# Altium project Carrier_Board_V2.PrjPcb (part 1 of 2)
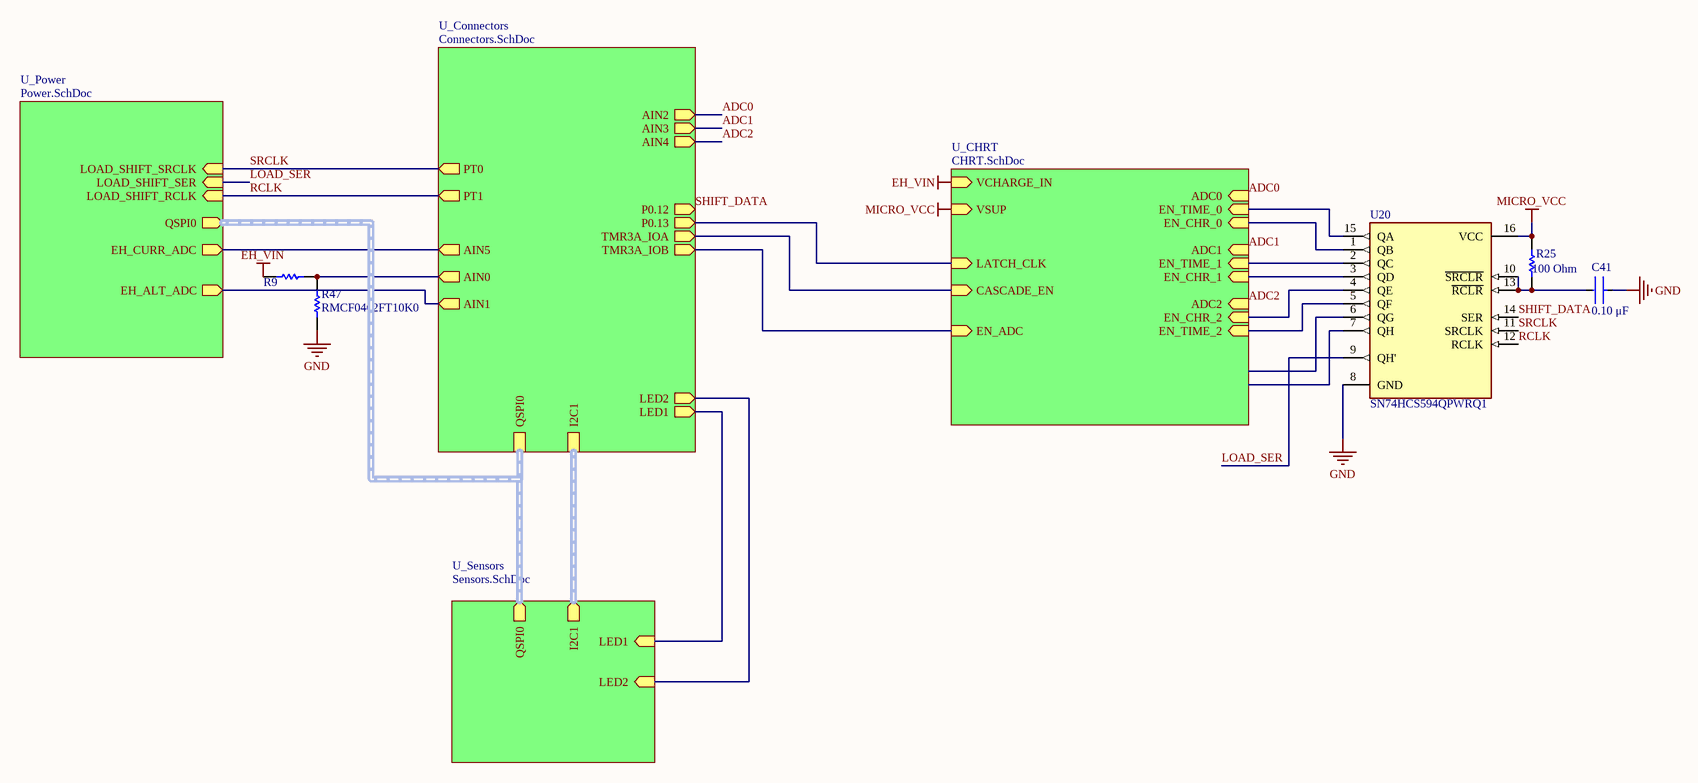
[diagram p0: TOP.SchDoc]
6 sheets, 157 parts. Net scope: hierarchical (ports join the sheet entries above them; power ports are global).
Board file: PCB2.PcbDoc
Sheets:
  TOP.SchDoc
    U_Power = Power.SchDoc
      U_em_storage = em_storage.SchDoc
    U_Connectors = Connectors.SchDoc
    U_CHRT = CHRT.SchDoc
      HRT = HRT.SchDoc

## Sheet TOP.SchDoc
size A3; SheetNumber: 1; SheetTotal: 9

### Parts
C41  Capacitance: 0.10 μF  [FP-C0402-BB-MFG]  (hidden comment: C0402C104K8PACTU)
R9  RC0402JR-075M6L  [RESC1005X40X25ML05T10]  (value not drawn)
R25  Resistance: 100 Ohm  [RESC1005X40X25LL05T05]  (hidden comment: ERJ-2RKF1000X)
R47  RMCF0402FT10K0  [RESC1005X40X25ML05T10]
U20  SN74HCS594QPWRQ1  [FP-PW0016A-IPC_A]

### Sub-sheets
U_CHRT = CHRT.SchDoc: VCHARGE_IN (in), VSUP (in), LATCH_CLK (in), CASCADE_EN (in), EN_ADC (in), ADC1 (in), EN_TIME_0 (in), ADC0 (in), EN_CHR_1 (in), EN_CHR_0 (in), EN_CHR_2 (in), EN_TIME_2 (in), EN_TIME_1 (in), ADC2 (in)
U_Connectors = Connectors.SchDoc: I2C1 (harness I2C1), QSPI0 (harness QSPI0), AIN2 (out), AIN3 (out), AIN4 (out), AIN5 (out), TMR3A_IOA (out), TMR3A_IOB (out), PT0 (out), PT1 (out), P0.12 (out), P0.13 (out), AIN0 (out), AIN1 (out), LED2 (out), LED1 (out)
U_Power = Power.SchDoc: LOAD_SHIFT_SRCLK (in), LOAD_SHIFT_SER (in), LOAD_SHIFT_RCLK (in), QSPI0 (out, harness QSPI0), EH_CURR_ADC (out), EH_ALT_ADC (out)
U_Sensors = Sensors.SchDoc (file not in this document): I2C1 (out, harness I2C1), QSPI0 (out, harness QSPI0), LED1 (in), LED2 (in)

### Nets
EH_VIN: R9.1 ; sheet U_CHRT/VCHARGE_IN
GND: C41.1 R47.1 U20.8(GND)
MICRO_VCC: R25.2 U20.16(VCC) ; sheet U_CHRT/VSUP
ADC0: sheet U_Connectors/AIN2, sheet U_CHRT/ADC0
ADC1: sheet U_Connectors/AIN3, sheet U_CHRT/ADC1
ADC2: sheet U_Connectors/AIN4, sheet U_CHRT/ADC2
AIN0: R9.2 R47.2 ; sheet U_Connectors/AIN0
AIN1: sheet U_Power/EH_ALT_ADC, sheet U_Connectors/AIN1
AIN5: sheet U_Power/EH_CURR_ADC, sheet U_Connectors/AIN5
CASCADE_EN: sheet U_Connectors/TMR3A_IOA, sheet U_CHRT/CASCADE_EN
CLK: sheet U_Connectors/P0.13, sheet U_CHRT/LATCH_CLK
LOAD_SER: U20.9(QH') ; sheet U_Power/LOAD_SHIFT_SER
PCIF_D8: sheet U_Sensors/LED1, sheet U_Connectors/LED1
PCIF_D9: sheet U_Sensors/LED2, sheet U_Connectors/LED2
RCLK: U20.12(RCLK) ; sheet U_Power/LOAD_SHIFT_RCLK, sheet U_Connectors/PT1  [project net PT1]
SHIFT_DATA: U20.14(SER) ; sheet U_Connectors/P0.12
SRCLK: U20.11(SRCLK) ; sheet U_Power/LOAD_SHIFT_SRCLK, sheet U_Connectors/PT0  [project net PT0]
TMR3A_IOB: sheet U_Connectors/TMR3A_IOB, sheet U_CHRT/EN_ADC
NetC41_2: C41.2 R25.1 U20.10(~{SRCLR}) U20.13(~{RCLR})
NetR32_2: U20.3(QD) ; sheet U_CHRT/EN_CHR_1
NetR33_2: U20.1(QB) ; sheet U_CHRT/EN_CHR_0
NetU20_2: U20.2(QC) ; sheet U_CHRT/EN_TIME_1
NetU20_4: U20.4(QE) ; sheet U_CHRT/EN_CHR_2
NetU20_5: U20.5(QF) ; sheet U_CHRT/EN_TIME_2
NetU20_15: U20.15(QA) ; sheet U_CHRT/EN_TIME_0

Not connected (* = marked no-connect by the designer): U20 6(QG) 7(QH)

### Buses and harness runs
harness sheet U_Connectors/I2C1 = sheet U_Sensors/I2C1
harness sheet U_Connectors/QSPI0 = sheet U_Power/QSPI0 = sheet U_Sensors/QSPI0

### Library data of the parts
C41 = CMP-2008-02046-2: CAP CER 0.1UF 10V X5R 0402; Manufacturer: Kemet; Material: Ceramic; Temperature Coefficient: 15%; Tolerance: 0.1; Value: 0.10 μF; Package: C0402-BB; Temperature: -55°C to +125°C; ComponentLink2Description: Datasheet; Temperature Characteristic: X5R; Device Class L1: Passive Components; Height: 0.55mm; Lead Free: Yes; ComponentLink2URL: https://content.kemet.com/datasheets/KEM_C1002_X7R_SMD.pdf; Device Class L2: Capacitors; Temperature Range Low: -55°C; Temperature Range High: +125°C; RoHS: TRUE; Octopart: https://octopart.com/c0402c104k8pactu-kemet-140039; Automotive: No; Mouser Description: Capacitor 100 nF 10 VDC 0402; Category: Cap; Voltage Rating: 10 V; Digikey Description: CAP CER 0.1UF 10V X5R 0402; Ipc Land Pattern Name: CAPC10050X50; Device Class L3: Ceramic Capacitors; Manufacturer Part Number: C0402C104K8PACTU
R9 = CMP-2002-07139-1: Manufacturer: Yageo / Phycomp; Part Number: RC0402JR-075M6L
R25 = CMP-2002-00605-3: Chip Resistor, 100 Ohm, +/- 1%, 100 mW, -55 to 155 degC, 0402 (1005 Metric), RoHS, Tape and Reel; Manufacturer: Basic Passives; Power Rating: 100 mW; Voltage Rating: 50 V; Case\/Package: 0402; Width: 0.5 mm; Pins: 2; ComponentLink2Description: Datasheet; PackageReference: 0402; Height: 0.35 mm; Tolerance: 1%; DatasheetVersion: 04/2015; Case Code (Imperial): 0402; Min Operating Temperature: -55 degC; Radiation Hardening: No; Length: 1 mm; Package Quantity: 10000; PackageDescription: 2-Pin Surface Mount Device, Body 1 x 0.5 mm; Mounting Technology: Surface Mount; Case Code (Metric): 1005; Packaging: Tape and Reel; ComponentLink1URL: http://www.panasonic.com/; RoHSCompliant: true; Max Operating Temperature: 155 degC; REACH SVHC: Yes; PartNumber: ERJ-2RKF1000X; ComponentLink1Description: Manufacturer URL; ComponentLink2URL: http://industrial.panasonic.com/cdbs/www-data/pdf/RDA0000/AOA0000C86.pdf; Mount: Surface Mount
R47 = CMP-2002-07490-1: Manufacturer: Yageo / Phycomp; Part Number: RC0402FR-071ML
U20 = CMP-04904-000006-1: AUTOMOTIVE 8-BIT SHIFT REGISTERS

## Sheet Power.SchDoc
size A4; SheetNumber: 4; SheetTotal: 9
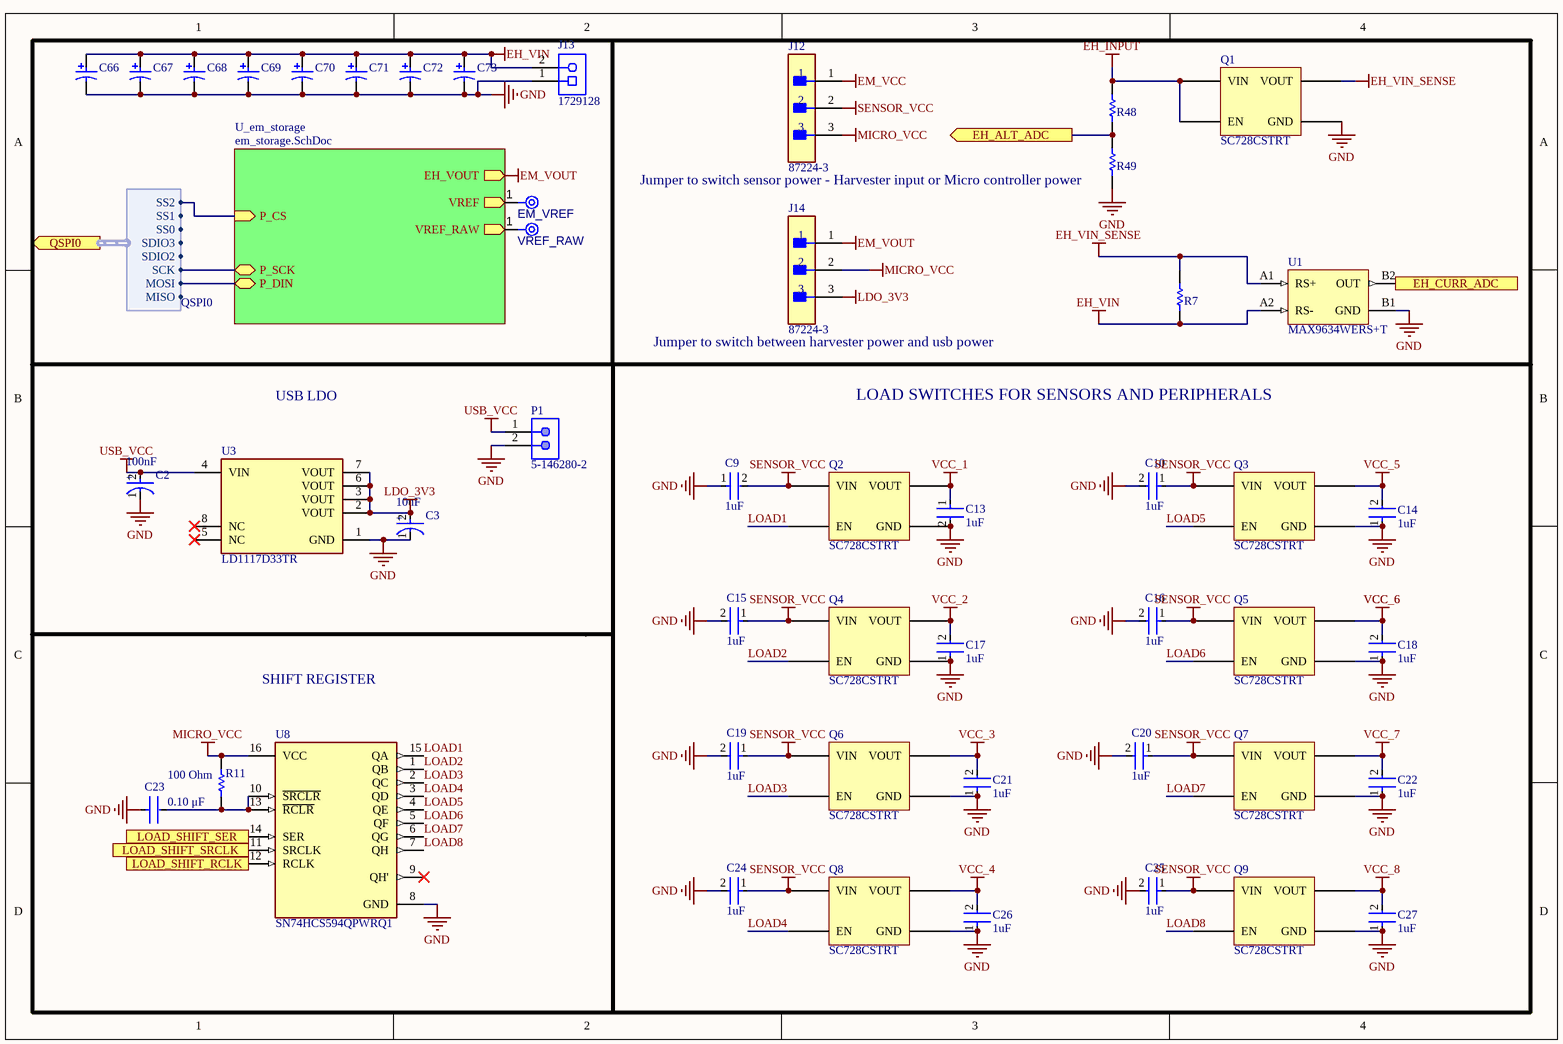
[diagram p1: Power.SchDoc]

### Parts
C2  Capacitance: 100nF  [FP-T491A104K035AT-MFG]  (hidden comment: T491A104K035AT)
C3  Capacitance: 10uF  [FP-TAJA-MFG]  (hidden comment: TAJA106K006RNJ)
C9  Capacitance: 1uF  [FP-GRM15-0_1-MFG]  (hidden comment: GRT155R61C105KE01J)
C10  Capacitance: 1uF  [FP-GRM15-0_1-MFG]  (hidden comment: GRT155R61C105KE01J)
C13  Capacitance: 1uF  [FP-GRM15-0_1-MFG]  (hidden comment: GRT155R61C105KE01J)
C14  Capacitance: 1uF  [FP-GRM15-0_1-MFG]  (hidden comment: GRT155R61C105KE01J)
C15  Capacitance: 1uF  [FP-GRM15-0_1-MFG]  (hidden comment: GRT155R61C105KE01J)
C16  Capacitance: 1uF  [FP-GRM15-0_1-MFG]  (hidden comment: GRT155R61C105KE01J)
C17  Capacitance: 1uF  [FP-GRM15-0_1-MFG]  (hidden comment: GRT155R61C105KE01J)
C18  Capacitance: 1uF  [FP-GRM15-0_1-MFG]  (hidden comment: GRT155R61C105KE01J)
C19  Capacitance: 1uF  [FP-GRM15-0_1-MFG]  (hidden comment: GRT155R61C105KE01J)
C20  Capacitance: 1uF  [FP-GRM15-0_1-MFG]  (hidden comment: GRT155R61C105KE01J)
C21  Capacitance: 1uF  [FP-GRM15-0_1-MFG]  (hidden comment: GRT155R61C105KE01J)
C22  Capacitance: 1uF  [FP-GRM15-0_1-MFG]  (hidden comment: GRT155R61C105KE01J)
C23  Capacitance: 0.10 μF  [FP-C0402-BB-MFG]  (hidden comment: C0402C104K8PACTU)
C24  Capacitance: 1uF  [FP-GRM15-0_1-MFG]  (hidden comment: GRT155R61C105KE01J)
C25  Capacitance: 1uF  [FP-GRM15-0_1-MFG]  (hidden comment: GRT155R61C105KE01J)
C26  Capacitance: 1uF  [FP-GRM15-0_1-MFG]  (hidden comment: GRT155R61C105KE01J)
C27  Capacitance: 1uF  [FP-GRM15-0_1-MFG]  (hidden comment: GRT155R61C105KE01J)
C66  T491D106K025AT  [KEMT-T491-D_L]  (value not drawn)
C67  T491D106K025AT  [KEMT-T491-D_L]  (value not drawn)
C68  T491D106K025AT  [KEMT-T491-D_L]  (value not drawn)
C69  T491D106K025AT  [KEMT-T491-D_L]  (value not drawn)
C70  T491D106K025AT  [KEMT-T491-D_L]  (value not drawn)
C71  T491D106K025AT  [KEMT-T491-D_L]  (value not drawn)
C72  T491D106K025AT  [KEMT-T491-D_L]  (value not drawn)
C73  T491D106K025AT  [KEMT-T491-D_L]  (value not drawn)
EM_VREF  TPAD6R  [TP06R]  (value not drawn)  (no BOM)
J12  87224-3  [FP-87224-3-MFG]
J13  1729128  [PHOE-1729128-2_V]
J14  87224-3  [FP-87224-3-MFG]
P1  5-146280-2  [TECO-5-146280-2_V]
Q1  SC728CSTRT  [PCBComponent_1]
Q2  SC728CSTRT  [PCBComponent_1]
Q3  SC728CSTRT  [PCBComponent_1]
Q4  SC728CSTRT  [PCBComponent_1]
Q5  SC728CSTRT  [PCBComponent_1]
Q6  SC728CSTRT  [PCBComponent_1]
Q7  SC728CSTRT  [PCBComponent_1]
Q8  SC728CSTRT  [PCBComponent_1]
Q9  SC728CSTRT  [PCBComponent_1]
R7  WSL0603R0300FEA18  [RESC1508X46X38ML25T25]  (value not drawn)
R11  Resistance: 100 Ohm  [RESC1005X40X25LL05T05]  (hidden comment: ERJ-2RKF1000X)
R48  RC0402FR-071ML  [RESC1005X40X25NL05T10]  (value not drawn)
R49  RC0402FR-071ML  [RESC1005X40X25NL05T10]  (value not drawn)
U1  MAX9634WERS+T  [MAXM-R41A1+1]
U3  LD1117D33TR  [FP-SO-8-0016023-MFG]
U8  SN74HCS594QPWRQ1  [FP-PW0016A-IPC_A]
VREF_RAW  TPAD6R  [TP06R]  (value not drawn)  (no BOM)

### Sub-sheets
U_em_storage = em_storage.SchDoc: P_SCK (bidir), P_DIN (bidir), P_CS (in), VREF_RAW (out), VREF (out), EH_VOUT (out)

### Ports
EH_ALT_ADC (out), EH_CURR_ADC (out), LOAD_SHIFT_RCLK (in), LOAD_SHIFT_SER (in), LOAD_SHIFT_SRCLK (in), QSPI0 (out, harness QSPI0)

### Harnesses
QSPI0: MISO, MOSI, SCK, SDIO2, SDIO3, SS0, SS1, SS2

### Nets
EH_INPUT: Q1.A2(VIN) Q1.B2(EN) R48.2
EH_VIN: C66.1 C67.1 C68.1 C69.1 C70.1 C71.1 C72.1 C73.1 J13.2 R7.1 U1.A2(RS-)
EH_VIN_SENSE: Q1.A1(VOUT) R7.2 U1.A1(RS+)
EM_VCC: J12.1
EM_VOUT: J14.1 ; sheet U_em_storage/EH_VOUT
EM_VREF: EM_VREF.1(TP) ; sheet U_em_storage/VREF
GND: C2.1(C) C3.1(C) C9.1 C10.2 C13.2 C14.1 C15.2 C16.2 C17.1 C18.1 C19.2 C20.2 C21.1 C22.1 C23.1 C24.2 C25.2 C26.1 C27.1 C66.2 C67.2 C68.2 C69.2 C70.2 C71.2 C72.2 C73.2 J13.1 P1.2 Q1.B1(GND) Q2.B1(GND) Q3.B1(GND) Q4.B1(GND) Q5.B1(GND) Q6.B1(GND) Q7.B1(GND) Q8.B1(GND) Q9.B1(GND) R49.1 U1.B1(GND) U3.1(GND) U8.8(GND)
LDO_3V3: C3.2(A) J14.3 U3.2(VOUT) U3.3(VOUT) U3.6(VOUT) U3.7(VOUT)
MICRO_VCC: J12.3 J14.2 R11.2 U8.16(VCC)
SENSOR_VCC: C9.2 C10.1 C15.1 C16.1 C19.1 C20.1 C24.1 C25.1 J12.2 Q2.A2(VIN) Q3.A2(VIN) Q4.A2(VIN) Q5.A2(VIN) Q6.A2(VIN) Q7.A2(VIN) Q8.A2(VIN) Q9.A2(VIN)
USB_VCC: C2.2(A) P1.1 U3.4(VIN)
VCC_1: C13.1 Q2.A1(VOUT)
VCC_2: C17.2 Q4.A1(VOUT)
VCC_3: C21.2 Q6.A1(VOUT)
VCC_4: C26.2 Q8.A1(VOUT)
VCC_5: C14.2 Q3.A1(VOUT)
VCC_6: C18.2 Q5.A1(VOUT)
VCC_7: C22.2 Q7.A1(VOUT)
VCC_8: C27.2 Q9.A1(VOUT)
AIN1: R48.1 R49.2 ; port EH_ALT_ADC
AIN5: U1.B2(OUT) ; port EH_CURR_ADC
I2C0_SCL: sheet U_em_storage/P_CS, port QSPI0.SS2
LOAD1: Q2.B2(EN) U8.15(QA)
LOAD2: Q4.B2(EN) U8.1(QB)
LOAD3: Q6.B2(EN) U8.2(QC)
LOAD4: Q8.B2(EN) U8.3(QD)
LOAD5: Q3.B2(EN) U8.4(QE)
LOAD6: Q5.B2(EN) U8.5(QF)
LOAD7: Q7.B2(EN) U8.6(QG)
LOAD8: Q9.B2(EN) U8.7(QH)
LOAD_SER: U8.14(SER) ; port LOAD_SHIFT_SER
PT0: U8.11(SRCLK) ; port LOAD_SHIFT_SRCLK
PT1: U8.12(RCLK) ; port LOAD_SHIFT_RCLK
QSPI0_MOSI: sheet U_em_storage/P_DIN, port QSPI0.MOSI
QSPI0_SCK: sheet U_em_storage/P_SCK, port QSPI0.SCK
NetC23_2: C23.2 R11.1 U8.10(~{SRCLR}) U8.13(~{RCLR})
NetR16_2: VREF_RAW.1(TP) ; sheet U_em_storage/VREF_RAW

Not connected (* = marked no-connect by the designer): U3 5(NC)* 8(NC)*; U8 9(QH')*

### Notes on the sheet
- (near R49) Jumper to switch sensor power - Harvester input or Micro controller power
- (near J14) Jumper to switch between harvester power and usb power
- USB LDO
- LOAD SWITCHES FOR SENSORS AND PERIPHERALS
- SHIFT REGISTER
- (in symbol CMP-03017-000018-1) +
- (in symbol CMP-04424-000097-1) +

### Library data of the parts
C2 = CMP-03017-000018-1: CAP TANT 0.1UF 10% 35V 1206; Dissipation Factor: 4%; ESR (Equivalent Series Resistance): 20R; Polarity: Polar; Dielectric Material: Tantalum; Leakage Current: 500nA; Ripple Current: 61mA; Life (Hours): 2000Hour; Width: 1.6mm; Radiation Hardening: No; Lead Free: Lead Free; Case Code (Metric): 3216; REACH SVHC: No SVHC; Termination: SMD/SMT; Tolerance: 10%; Height - Seated (Max): 0.071inch; Series: T491; Features: General Purpose; Lead Pitch: 1.2mm; RoHS Compliant: Yes; Number of Pins: 2; Voltage: 35V; Packaging: Tape and Reel; Depth: 1.6mm; Length: 3.2mm; Case Code (Imperial): 1206; Construction: Flat; Min Operating Temperature: -55°C; Max Operating Temperature: 125°C; Height: 1.6mm; Voltage Rating: 35V; Case/Package: 1206; Package Quantity: 1; Weight: 0.000571oz; Size: 1.6mm; Voltage Rating (DC): 35V; Mount: Surface Mount
C3 = CMP-04424-000097-1: 10uF 6.3V  ±10% 4Ω 1206  SMD Tantalum Capacitor; Leakage Current: 600nA; Q Factor: 6; Polarity: Polar; ESR (Equivalent Series Resistance): 4R; Dissipation Factor: 6%; Tolerance: 20%; Lead Free: Lead Free; Min Operating Temperature: -55°C; Case/Package: 1206; Voltage Rating (DC): 6.3V; Mount: Surface Mount; Termination: SMD/SMT; Depth: 1.6mm; Height: 1.6mm; Voltage: 6.3V; Features: General Purpose; Series: TAJ; Voltage Rating: 6.3V; Package Quantity: 1; Max Operating Temperature: 125°C; Width: 1.6mm; Length: 3.2mm; Construction: Flat; REACH SVHC: No SVHC; Case Code (Imperial): 1206; Radiation Hardening: No; RoHS Compliant: Yes; Dielectric Material: Tantalum; Height - Seated (Max): 0.071inch; Case Code (Metric): 3216; Packaging: Tape and Reel
C9 C10 C13-C22 C24-C27 = CMP-2008-04556-2: CAP CER 1UF 10V X5R 0402; Manufacturer Part Number: GRM155R61A105KE15D; Manufacturer: Murata; Material: Ceramic; Tolerance: 10%; Temperature Coefficient: 15%; Octopart: https://octopart.com/grm155r61a105ke15d-murata-197442; Lead Free: Yes; ComponentLink2Description: Datasheet; Temperature: -55°C to +85°C; Temperature Range High: +85°C; Height: 0.55mm; Ipc Land Pattern Name: CAPC10050X50; ComponentLink2URL: https://search.murata.co.jp/Ceramy/image/img/A01X/G101/ENG/GRM155R61A105KE15-01A.pdf; Temperature Range Low: -55°C; Device Class L2: Capacitors; Voltage Rating: 10V; RoHS: TRUE; Device Class L1: Passive Components; Device Class L3: Ceramic Capacitors; Temperature Characteristic: X5R; Mouser Description: 0402 1 uF 10 V ±10% Tolerance X5R Surface Mount Multilayer Ceramic Capacitor; Automotive: No; Package: GRM15-0.1; Digikey Description: CAP CER 1UF 10V X5R 0402; Value: 1uF; Category: Cap
C23 = CMP-2008-02046-2: as C41 on sheet TOP; Package: C0402-BB; Temperature: -55°C to +125°C; ComponentLink2Description: Datasheet; Temperature Characteristic: X5R; Device Class L1: Passive Components; Height: 0.55mm; Lead Free: Yes; ComponentLink2URL: https://content.kemet.com/datasheets/KEM_C1002_X7R_SMD.pdf; Device Class L2: Capacitors; Temperature Range Low: -55°C; Temperature Range High: +125°C; RoHS: TRUE; Octopart: https://octopart.com/c0402c104k8pactu-kemet-140039; Automotive: No; Mouser Description: Capacitor 100 nF 10 VDC 0402; Category: Cap; Voltage Rating: 10 V; Digikey Description: CAP CER 0.1UF 10V X5R 0402; Ipc Land Pattern Name: CAPC10050X50; Device Class L3: Ceramic Capacitors; Manufacturer Part Number: C0402C104K8PACTU
C66-C73 = CMP-2000-07200-1: Tantalum Capacitor, 10 uF, +/- 10%, 25 V, -55 to 125 degC, 2-Pin SMD, RoHS, Tape and Reel; Manufacturer: Kemet; Insulation: NotRequired; Rad Hardened: No; Case Style: Molded; Polarity: Polar; Product Height (mm): 2.8mm; Capacitance: 10000000pF; Product Length (mm): 7.3mm; DF: 6%; ESR: 1ohm; Product Diameter (mm): NotRequiredmm; Voltage: 25VDC; Product Depth (mm): 4.3mm; DCL: 2.5uA; Mounting Style: SurfaceMount; Construction: SMTChip; Failure Rate: NotRequired; Operating Temp Range: -55Cto125C; Packaging: TapeandReel; Length W/Weld: NotRequiredmm; Package Reference: T491-D; Datasheet Version: 10/2016; Package / Case: 7343-31; Wire Form: NotRequired; Seated Plane Height: NotRequiredmm; Length W/Weld (max): NotRequiredmm; Package Description: 2-Pin Surface Mount Device, Body 7.3 x 4.3 mm; Tolerance (+ or -): 10%; Manufacturer URL: http://www.kemet.com/; Datasheet URL: http://capacitoredge.kemet.com/capedge2/DataSheet/Datasheet-T491D106K025AT.pdf?pn=T491D106K025AT; Case Code: D; Mounting Technology: SurfaceMount; Seal: NotRequired; Lead Spacing (nom): NotRequiredmm
EM_VREF VREF_RAW = CMP-00028-00002-2: 0.6mm round; Pins: 1
J12 J14 = CMP-2000-05697-2: CONN HEADER VERT 3POS 2.54MM; Number of Positions: 3; Gasket: No (Without); High Speed Serial Data Connector: No; Current Rating: 3A; Contact Post Length: 0.125inch; PCB Thickness: 1.397mm; PCB Mount Retention: Without; Connector Type: Plug; Approvals: CSA; PCB Mounting Orientation: Vertical; Pitch: 2.54mm; Mating Alignment: No (Without); Housing Color: Black; Contact Gender: Male; Length: 7.21mm; Max Operating Temperature: 105°C; Strain Relief: No (Without); Contact Material: Bronze; Row Spacing: 2.54mm; Series: AMPMODU MOD II; Board Standoff: No (Without); Package Quantity: 520; Radiation Hardening: No; Contact Protection: No (Without); Stabilizers: No (Without); Number of Rows: 1; Contact Mating Length: 8.08mm; Contact Shape: Square; Depth: 2.54mm; Contact Current Rating: 3A; Flammability Rating: UL94 V-0; Packaging: Carton; Number of Contacts: 3; Orientation: Straight; Mount: Through Hole; Keyed: No; Contact Type: Male Pin; Housing Material: Thermoplastic; High Temperature Housing: No; ELV: Compliant; Contact Plating: Gold; Termination: Through Hole; Selectively Loaded: No (Without); Lead Free: Lead Free; Min Operating Temperature: -65°C; Mating Connector Lock: No (Without); Color: Black; RoHS Compliant: Yes
J13 = CMP-2000-05815-1: PCB Terminal Block, 13.5 A, 400 V, 2-Pin THD, RoHS, Bulk; Manufacturer: Phoenix Contact; Package Version: 03/2015; No. of Rows: 1; Pitch: 5.08mm; No. of Positions: 2; Voltage Rating: 400V; Current Rating: 13500mA; Manufacturer URL: http://www.phoenixcontact.com/; Datasheet URL: https://datasheet.ciiva.com/16046/1729128-16046181.pdf; RoHS: TRUE; Package URL: https://www.phoenixcontact.com/online/portal/pi/pxc/product_detail_page/!ut/p/b1/3VdJjqNKFDxLH8AFycySyWY2ozFsEPOMMQaDOX1XedGL_1Vdm5YXJleknhSKeBkvI6EA8ncAo3AYoDhBQGco6KN7VURTdemj9us_IEKEZo_YHiPAEWEFmDGOHMORkqKYCORBZxgL7ZoaZYcbFFUZ3fqxSY6GOuxydWUuHqz1ynmMFygu583Bob0Ewr6Sd_l-5m-kAueHiB0jpRwZwe58wwtkpxtMYd_LmGcDRU02dRNEyWt6Y2ti5pSyJ_reIkzIulrqApdnbT11V5jnCKbYNCvhEM1MCpPByat_X379-iThf08CI5GfOPqfBeS3BRoBOdD55AKVv0iLwCMq-2BrzXWSGRH7pUGD9uwXQjiph3xL0DKQwdGa0JImiIOmBNOestqgwTHSSs2oOep-78apyXQBvNi8ZLaFjvjWvcaUEBu0MC6Wbe-d6mB0FAebo2lUWinqYaZs5DAYzV0RP9yitUjnGJ0iI9xhZkT42OCQNUJJhkgWINNQLP2JFP6OpMg3JCVg70jqHT0lvKOnhHf0lPuOnnLf0VPuWx6_dxwUIvwk5WMkT0kLL1mh61l2yZVSzG3pYV_bqo-mj6uMKwKwdnnW8Jh5RTOJzMOA5c-eJDaZQw4mTMPH02PvS_ZAqNVjVTo2WyYLkwH_KU1mmmG5kjRhDqPXLwwVHvVOjCM60-fpXvTDfMGW1PVFVS1r4e4yVDk4ZdNbkUHvqPqQSeian4UD39fNKmachqdJ1NJbyk8rXT9mXTvPk3oE5meulKGgiruPJek-4I9hTT6G8ZLOyRSm2RRVbThERQad5OS28hdt4YW4vG0stgYYzsWsK4_7y6DZMjJSCqri1kyiZR5vD7pwIrNR7QwPHTcLTI5qT7eRlpHrdGiupYlqQDJ7zy_CND8fWWBoLRXxk1RVcXiBQwbTD4Xi7KL-FuO94t9xaqweXzH; PartNumber: 1729128; Package Description: 2-Pin Through Hole Device, Body 8.1 x 10.16 mm, Pitch 5.08 mm; Datasheet Version: 12/2013; Mounting Technology: ThroughHole; Orientation: Horizontal; Package Reference: 1729128-2; Packing: Bulk
P1 = CMP-2000-07492-1: Male Header, Pitch 2.54 mm, 1 x 2 Position, Height 8.21 mm, Tail Length 3.05 mm, -65 to 105 degC, RoHS, Bulk; Manufacturer: TE Connectivity; Mating Connector Lock: No(Without); Number of Positions: 2; Pitch: 2.54mm; PCB Mounting Orientation: Vertical; Keyed: No; Case\/Package: 100; Mating Post Length: 0.23inch; High Temperature Housing: Yes; Max Current Rating: 5A; PCB Thickness: 0.063inch; PCB Mount Retention: Without; Approvals: CSA; Current Rating: 3A; Radiation Hardening: No; Length: 4.67mm; Contact Mating Length: 0.23inch; Connector Type: Header; Number of Rows: 1; Termination Post Length: 0.12inch; Board Standoff: No(Without); Max Operating Temperature: 105degC; Contact Shape: Square; Selectively Loaded: No(Without); Gasket: No(Without); Number of Contacts: 2; Contact Gender: Male; Mating Alignment: No(Without); Manufacturer URL: http://www.te.com/; Datasheet URL: http://www.te.com/commerce/DocumentDelivery/DDEController?Action=showdoc&DocId=Customer+Drawing%7F146280%7FH1%7Fpdf%7FEnglish%7FENG_CD_146280_H1.pdf%7F5-146280-2; Mount: ThroughHole; Orientation: Straight; Packaging: Carton; Package Reference: 5-146280-2; Package Quantity: 500; Stabilizers: No(Without); Row Spacing: 2.54mm; Contact Material: CopperAlloy; Panel Mount Retention: No(Without); Datasheet Version: Rev. H1, 08/2016; Housing Colour: Black; Colour: Black; Package Description: Male Header, Pitch 2.54 mm, 1 x 2 Position, Height 8.21 mm, Tail Length 3.05 mm; Contact Plating: Matte; Housing Material: Polymer; Contact Protection: No(Without); Min Operating Temperature: -65degC; Mounting Technology: ThroughHole; Flammability Rating: UL94V-0; RoHSCompliant: true; Termination: ThroughHole; Depth: 2.34mm; High Speed Serial Data Connector: No
R7 = CMP-2000-03807-1: Manufacturer: Vishay Dale; Part Number: WSL0603R0300FEA18
R11 = CMP-2002-00605-3: as R25 on sheet TOP; Width: 0.5 mm; Pins: 2; ComponentLink2Description: Datasheet; PackageReference: 0402; Height: 0.35 mm; Tolerance: 1%; DatasheetVersion: 04/2015; Case Code (Imperial): 0402; Min Operating Temperature: -55 degC; Radiation Hardening: No; Length: 1 mm; Package Quantity: 10000; PackageDescription: 2-Pin Surface Mount Device, Body 1 x 0.5 mm; Mounting Technology: Surface Mount; Case Code (Metric): 1005; Packaging: Tape and Reel; ComponentLink1URL: http://www.panasonic.com/; RoHSCompliant: true; Max Operating Temperature: 155 degC; REACH SVHC: Yes; PartNumber: ERJ-2RKF1000X; ComponentLink1Description: Manufacturer URL; ComponentLink2URL: http://industrial.panasonic.com/cdbs/www-data/pdf/RDA0000/AOA0000C86.pdf; Mount: Surface Mount
R48 = CMP-2002-07490-1: 3M ohm; Manufacturer: Yageo / Phycomp; Part Number: RC0402FR-071ML
R49 = CMP-2002-07490-1: 1M ohm; Manufacturer: Yageo / Phycomp; Part Number: RC0402FR-071ML
U1 = CMP-0252-00019-2: 1 uA, 4-Bump, Precision Current-Sense Amplifier, 200 V / V Gain, -40 to 85 degC, 4-Pin BGA (R41A1+1), Pb-Free, Tape and Reel; Gain: 25 V/V, 50 V/V ,100 V/V ,200 V/V; Bi-Dir. Curr. Sense: No; ComponentLink2Description: Datasheet; ComponentLink3URL: http://pdfserv.maximintegrated.com/package_dwgs/21-0242.PDF; Mounting Technology: Surface Mount; PackageVersion: Rev. A, 06/2008; ComponentLink2URL: http://datasheets.maximintegrated.com/en/ds/MAX9634.pdf; ComponentLink1URL: http://www.maximintegrated.com/; PartNumber: MAX9634WERS+T; PackageDescription: 4-Pin Ultra Chip-Scale Package, Body 1 x 1 mm, Pitch 0.5 mm; ComponentLink3Description: Package Specification; ComponentLink1Description: Manufacturer URL; PackageReference: R41A1+1; DatasheetVersion: Rev. 2
U3 = CMP-0244-00261-2: IC REG LINEAR 3.3V 800MA 8SO; Polarity: Positive; Number of Outputs: 1; Quiescent Current: 10mA; Power Dissipation: 12W; Max Output Current: 1.3A; Dropout Voltage: 1.1V; Accuracy: 1%; Input Bias Current: 5mA; Output Type: Fixed; Max Input Voltage: 15V; Min Output Voltage: 3.3V; Width: 4mm; Lead Free: Lead Free; Min Operating Temperature: 0°C; Packaging: Tape and Reel; Output Current: 800mA; Length: 5mm; Output Voltage Accuracy: 1%; Number of Regulators: 1; Max Power Dissipation: 12W; Case/Package: SO; Output Voltage: 3.3V; Number of Pins: 8; Package Quantity: 1; Max Operating Temperature: 150°C; Radiation Hardening: No; Height: 1.65mm; Mount: Surface Mount
U8 = CMP-04904-000006-1: AUTOMOTIVE 8-BIT SHIFT REGISTERS

## Sheet em_storage.SchDoc
size A; SheetNumber: 5; SheetTotal: 9
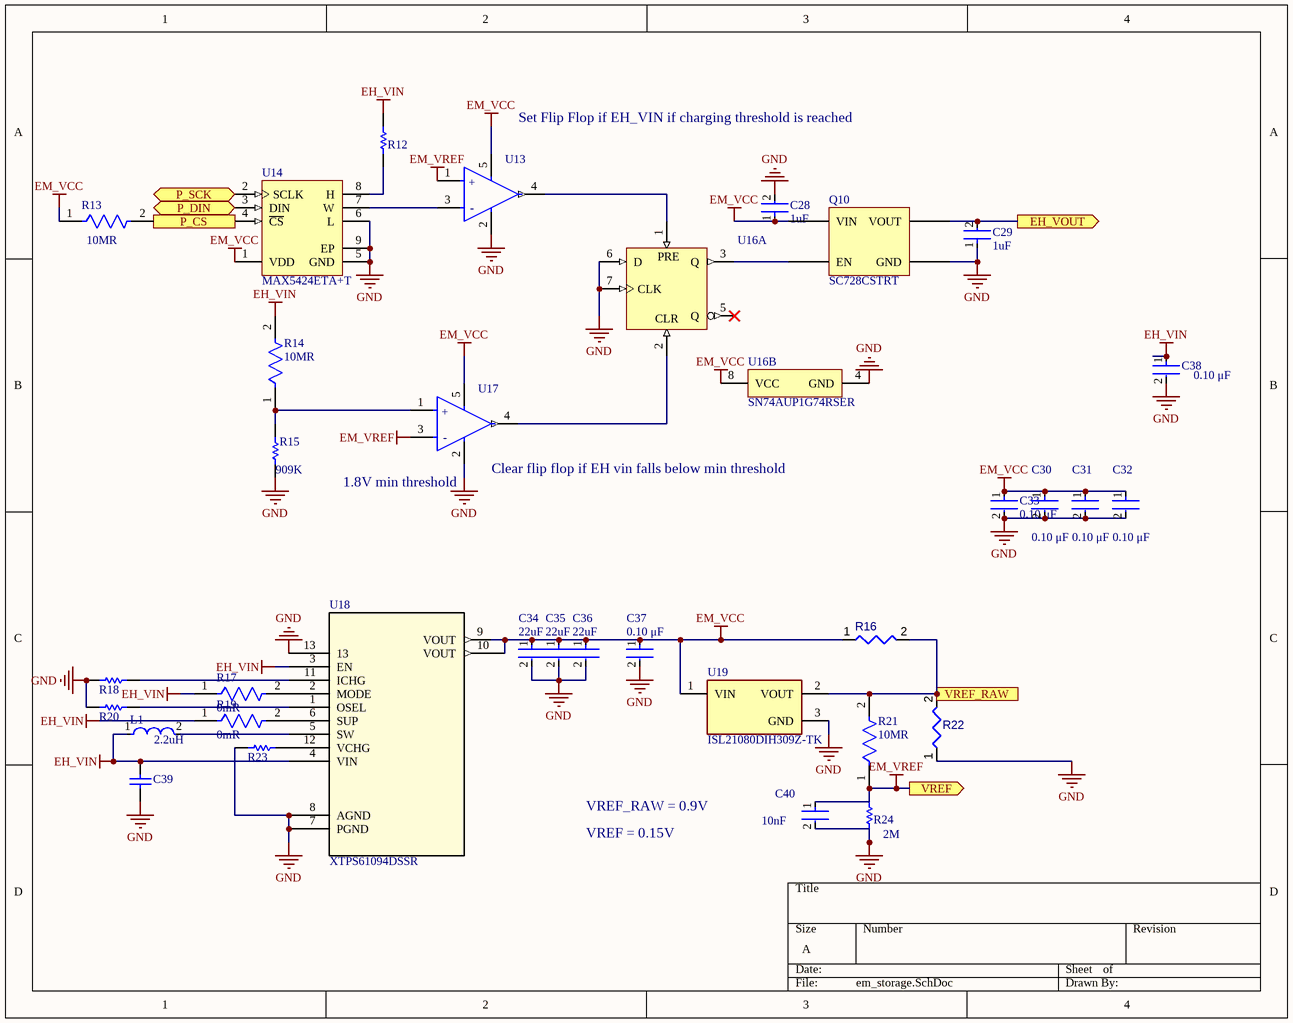
[diagram p2: em_storage.SchDoc]

### Parts
C28  Capacitance: 1uF  [FP-GRM15-0_1-MFG]  (hidden comment: GRT155R61C105KE01J)
C29  Capacitance: 1uF  [FP-GRM15-0_1-MFG]  (hidden comment: GRT155R61C105KE01J)
C30  Capacitance: 0.10 μF  [FP-C0402-BB-MFG]  (hidden comment: C0402C104K8PACTU)
C31  Capacitance: 0.10 μF  [FP-C0402-BB-MFG]  (hidden comment: C0402C104K8PACTU)
C32  Capacitance: 0.10 μF  [FP-C0402-BB-MFG]  (hidden comment: C0402C104K8PACTU)
C33  Capacitance: 0.10 μF  [FP-C0402-BB-MFG]  (hidden comment: C0402C104K8PACTU)
C34  Capacitance: 22uF  [FP-CL05A226MQ5N6J8-IPC_C]  (hidden comment: 04024D226MAT2A)
C35  Capacitance: 22uF  [FP-CL05A226MQ5N6J8-IPC_C]  (hidden comment: 04024D226MAT2A)
C36  Capacitance: 22uF  [FP-CL05A226MQ5N6J8-IPC_C]  (hidden comment: 04024D226MAT2A)
C37  Capacitance: 0.10 μF  [FP-C0402-BB-MFG]  (hidden comment: C0402C104K8PACTU)
C38  value 0.10 μF  [FP-C0402-BB-MFG]  (hidden comment: C0402C104K4RACTU)
C39  C0402C225M9PACTU  [CAPC1005X55X30NL05T10]  (value not drawn)
C40  Capacitance: 10nF  [FP-GRM155-0_05-IPC_C]  (hidden comment: GRM155R71H103KA88D)
L1  Inductance: 2.2uH  [FP-LQM21PH_G0-IPC_C]  (hidden comment: LQM21PN2R2NGCD)
Q10  SC728CSTRT  [PCBComponent_1]
R12  RMCF0402JT2M00  [RESC1005X40X25LL05T05]  (value not drawn)
R13  Resistance: 10MR  [FP-CRCW0402-e3-IPC_C]  (hidden comment: CRCW040210M0JNED)
R14  Resistance: 10MR  [FP-CRCW0402-e3-IPC_C]  (hidden comment: CRCW040210M0JNED)
R15  Resistance: 909K  [RESC1005X40X25NL05T05]  (hidden comment: ERJ-2RKF9093X)
R16  Jumper 0603  [RESC0603(1608)_L]  (value not drawn)
R17  Resistance: 0mR  [FP-CRCW0402-e3-IPC_C]  (hidden comment: CRCW04020000Z0ED)
R18  RC0402JR-070RL  [RESC1005X40X25NL05T10]  (value not drawn)
R19  Resistance: 0mR  [FP-CRCW0402-e3-IPC_C]  (hidden comment: CRCW04020000Z0ED)
R20  RC0402JR-070RL  [RESC1005X40X25NL05T10]  (value not drawn)
R21  Resistance: 10MR  [FP-CRCW0402-e3-IPC_C]  (hidden comment: CRCW040210M0JNED)
R22  Jumper 0603  [RESC0603(1608)_L]  (value not drawn)
R23  RC0402JR-070RL  [RESC1005X40X25NL05T10]  (value not drawn)
R24  Resistance: 2M  [RESC1005X40X25LL05T05]  (hidden comment: RMCF0402JT2M00)
U13  TLV3691IDCKR  [FP-DCK0005A-IPC_A]  (value not drawn)
U14  MAX5424ETA+T  [MAXM-T833+2_V]
U16  SN74AUP1G74RSER  [RSE0008A_V]  (value not drawn)  (parts A,B of 2)
U17  TLV3691IDCKR  [FP-DCK0005A-IPC_A]  (value not drawn)
U18  XTPS61094DSSR  [WSON_94DSSR_TEX-L]
U19  ISL21080DIH309Z-TK  [Intersil_ISL21080DIH309Z-TK_0]

### Ports
EH_VOUT (out), P_CS (in), P_DIN (bidir), P_SCK (bidir), VREF (out), VREF_RAW (out)

### Nets
EH_VIN: C38.1 C39.2 L1.1 R12.1 R14.2 R17.1 R19.1 U18.3(EN) U18.4(VIN)
EM_VCC: C28.1 C30.1 C31.1 C32.1 C33.1 C34.1 C35.1 C36.1 C37.1 Q10.A2(VIN) R13.1 R16.1 U13.5(VCC) U14.1(VDD) U16.8(VCC) U17.5(VCC) U18.9(VOUT) U18.10(VOUT) U19.1(VIN)
EM_VOUT: C29.2 Q10.A1(VOUT) ; port EH_VOUT
EM_VREF: C40.1 R21.1 R24.2 U13.1(IN+) U17.3(IN-) ; port VREF
GND: C28.2 C29.1 C30.2 C31.2 C32.2 C33.2 C34.2 C35.2 C36.2 C37.2 C38.2 C39.1 C40.2 Q10.B1(GND) R15.1 R18.1 R20.1 R22.1 R23.1 R24.1 U13.2(GND) U14.5(GND) U14.6(L) U14.9(EP) U16.4(GND) U16.6(D) U16.7(CLK) U17.2(GND) U18.7(PGND) U18.8(AGND) U18.13 U19.3(GND)
I2C0_SCL: R13.2 U14.4(~{CS}) ; port P_CS
QSPI0_MOSI: U14.3(DIN) ; port P_DIN
QSPI0_SCK: U14.2(SCLK) ; port P_SCK
NetL1_2: L1.2 U18.5(SW)
NetQ10_B2: Q10.B2(EN) U16.3(Q)
NetR12_2: R12.2 U14.8(H)
NetR14_1: R14.1 R15.2 U17.1(IN+)
NetR16_2: R16.2 R21.2 R22.2 U19.2(VOUT) ; port VREF_RAW
NetR17_2: R17.2 U18.2(MODE)
NetR18_2: R18.2 U18.11(ICHG)
NetR19_2: R19.2 U18.6(SUP)
NetR20_2: R20.2 U18.1(OSEL)
NetR23_2: R23.2 U18.12(VCHG)
NetU13_3: U13.3(IN-) U14.7(W)
NetU13_4: U13.4(OUT) U16.1(~{PRE})
NetU16_2: U16.2(~{CLR}) U17.4(OUT)

Not connected (* = marked no-connect by the designer): U16 5(Q)*

### Notes on the sheet
- Set Flip Flop if EH_VIN if charging threshold is reached
- (near U17) 1.8V min threshold
- (near U17) Clear flip flop if EH vin falls below min threshold
- VREF_RAW = 0.9V
- VREF = 0.15V
- (in symbol CMP-0859-00978-3, part A) PRE; CLR
- (in symbol CMP-04896-000044-1) +; -

### Library data of the parts
C28 C29 = CMP-2008-04556-2: as C9 on sheet Power; Octopart: https://octopart.com/grm155r61a105ke15d-murata-197442; Lead Free: Yes; ComponentLink2Description: Datasheet; Temperature: -55°C to +85°C; Temperature Range High: +85°C; Height: 0.55mm; Ipc Land Pattern Name: CAPC10050X50; ComponentLink2URL: https://search.murata.co.jp/Ceramy/image/img/A01X/G101/ENG/GRM155R61A105KE15-01A.pdf; Temperature Range Low: -55°C; Device Class L2: Capacitors; Voltage Rating: 10V; RoHS: TRUE; Device Class L1: Passive Components; Device Class L3: Ceramic Capacitors; Temperature Characteristic: X5R; Mouser Description: 0402 1 uF 10 V ±10% Tolerance X5R Surface Mount Multilayer Ceramic Capacitor; Automotive: No; Package: GRM15-0.1; Digikey Description: CAP CER 1UF 10V X5R 0402; Value: 1uF; Category: Cap
C30-C33 C37 = CMP-2008-02046-2: as C41 on sheet TOP; Package: C0402-BB; Temperature: -55°C to +125°C; ComponentLink2Description: Datasheet; Temperature Characteristic: X5R; Device Class L1: Passive Components; Height: 0.55mm; Lead Free: Yes; ComponentLink2URL: https://content.kemet.com/datasheets/KEM_C1002_X7R_SMD.pdf; Device Class L2: Capacitors; Temperature Range Low: -55°C; Temperature Range High: +125°C; RoHS: TRUE; Octopart: https://octopart.com/c0402c104k8pactu-kemet-140039; Automotive: No; Mouser Description: Capacitor 100 nF 10 VDC 0402; Category: Cap; Voltage Rating: 10 V; Digikey Description: CAP CER 0.1UF 10V X5R 0402; Ipc Land Pattern Name: CAPC10050X50; Device Class L3: Ceramic Capacitors; Manufacturer Part Number: C0402C104K8PACTU
C34-C36 = CMP-13271-000001-1: CAP CER 22UF 6.3V X5R 0402; Manufacturer Part Number: CL05A226MQ5N6J8; Manufacturer: Samsung Electro-Mechanics; Material: Ceramic; Temperature Coefficient: 15%; Tolerance: 20%; Ipc Land Pattern Name: CAPC10050X50; Lead Free: Yes; Temperature Characteristic: X5R; Temperature: -55°C to +85°C; RoHS: TRUE; ComponentLink2Description: Datasheet; Device Class L3: Ceramic Capacitors; Device Class L1: Passive Components; Value: 22uF; Temperature Range High: +85°C; Automotive: No; Voltage Rating: 6.3V; Package: 0402; Category: Cap; Device Class L2: Capacitors; Height: 0.55mm; ComponentLink2URL: http://www.samsungsem.com/kr/support/library/product-catalog/__icsFiles/afieldfile/2018/11/28/MLCC.pdf; Temperature Range Low: -55°C; Octopart: https://octopart.com/cl05a226mq5n6j8-samsung-82337113; Digikey Description: CAP CER 22UF 6.3V X5R 0402
C38 = CMP-2008-02108-2: CAP CER 0.1UF 16V X7R 0402; Manufacturer: Kemet; Tolerance: 0.1; Material: Ceramic; Temperature Coefficient: 15%; Voltage Rating: 16 V; Package: C0402-BB; Automotive: No; Ipc Land Pattern Name: CAPC10050X50; Device Class L3: Ceramic Capacitors; Capacitance: 0.10 μF; Octopart: https://octopart.com/c0402c104k4ractu-kemet-94158; Temperature Characteristic: X7R; Mouser Description: Cap Ceramic 0.1uF 16V X7R 10% SMD 0402 125?C Paper T/R - Tape and Reel (Alt: C0402C104K4RAC TU); ComponentLink2Description: Datasheet; Temperature Range Low: -55°C; RoHS: TRUE; Device Class L1: Passive Components; Manufacturer Part Number: C0402C104K4RACTU; Temperature Range High: +125°C; Device Class L2: Capacitors; ComponentLink2URL: https://content.kemet.com/datasheets/KEM_C1002_X7R_SMD.pdf; Category: Cap; Height: 0.55mm; Temperature: -55°C to +125°C; Lead Free: Yes; Digikey Description: CAP CER 0.1UF 16V X7R 0402
C39 = CMP-2008-02064-2: Manufacturer: Kemet; Part Number: C0402C225M9PACTU
C40 = CMP-2008-04637-5: Chip Multilayer Ceramic Capacitors for General Purpose, 0402, 10000pF, X7R, 15%, 10%, 50V; Voltage: 25V; Tolerance: 10%; Mount: Surface Mount; Lead Free: Lead Free; Radiation Hardening: No; Case Code (Imperial): 0402; REACH SVHC: No SVHC; Case/Package: 0402; Dielectric: X7R; Voltage Rating (DC): 50V; Max Operating Temperature: 125°C; Termination: SMD/SMT; Material: Ceramic; Width: 0.02inch; Package Quantity: 1; Voltage Rating: 50V; Thickness: 0.022inch; Packaging: Tape and Reel; Height: 0.5mm; Number of Pins: 2; Case Code (Metric): 1005; Min Operating Temperature: -55°C; Length: 1mm; Depth: 0.5mm
L1 = CMP-06042-016317-1: Multilayer Type Inductor for Power Lines, 0805 (2012), 2.2μH, 30%, 0.288Ω, 0.8A; Test Frequency: 1MHz; Shielding: Shielded; Current Rating: 800mA; Self Resonant Frequency: 40MHz; Core Material: Ferrite; DC Resistance (DCR): 288mR; RoHS Compliant: Yes; REACH SVHC: No SVHC; Inductance Tolerance: 30%; Package Quantity: 4000; Military Standard: Not; Max Operating Temperature: 125°C; Radiation Hardening: No; Series: LQM; Height - Seated (Max): 0.039inch; Tolerance: 30%; Height: 0.9mm; Lead Free: Lead Free; Case Code (Metric): 2012; Packaging: Tape and Reel; Termination: SMD/SMT; Case Code (Imperial): 0805; Min Operating Temperature: -55°C; Depth: 1.4mm; Mount: Surface Mount; Length: 2mm; DC Current: 800mA; Case/Package: 0805; Max DC Current: 800mA; Width: 0.049inch
R12 = CMP-1011-00881-2: Manufacturer: Vishay Dale; Part Number: CRCW04022M00FKED; Resistance: 2M Ohm
R13 R14 R21 = CMP-1011-00170-3: RES Thick Film, 10MΩ, 5%, 0.063W, 200ppm/°C, 0402; Voltage Rating (DC): 50V; Max Power Dissipation: 63mW; Case Code (Metric): 1005; Tolerance: 5%; Lead Free: Lead Free; Length: 1mm; Packaging: Tape and Reel; Depth: 0.5mm; Composition: Thick Film; Temperature Coefficient: 200ppm/°C; Package Quantity: 1; Radiation Hardening: No; Weight: 2.3E-05oz; Width: 0.5mm; Military Standard: Not; Power Rating: 63mW; Case/Package: 0402; Termination: SMD/SMT; Height: 0.016inch; Voltage Rating: 50V; Contact Plating: Tin; Number of Terminations: 2; Features: Automotive AEC-Q200; Max Operating Temperature: 155°C; Case Code (Imperial): 0402; Min Operating Temperature: -55°C
R15 = CMP-2002-01101-1: Manufacturer: Panasonic; Part Number: ERJ-2RKF9093X
R16 R22 = CMP-009-00175-3: Value: 0; Pins: 2; Min Operating Temperature: -55°C; Max Operating Temperature: 155°C; Case/Package: 0603
R17 R19 = CMP-2002-08122-2: RES Thick Film, 0Ω, 0.063W, 0402; Tolerance: 5%; Max Power Dissipation: 63mW; Voltage Rating: 50V; Temperature Coefficient: 100ppm/°C; Contact Plating: Tin; Height: 0.35mm; Radiation Hardening: No; Features: Automotive AEC-Q200; Composition: Thick Film; Width: 0.5mm; Weight: 2.3E-05oz; Termination: SMD/SMT; Packaging: Tape and Reel; Mount: Surface Mount; Case Code (Metric): 1005; Military Standard: Not; Min Operating Temperature: -55°C; Number of Terminations: 2; Package Quantity: 1; Case Code (Imperial): 0402; Depth: 0.5mm; Max Operating Temperature: 155°C; Case/Package: 0402; Power Rating: 63mW; Lead Free: Lead Free; Voltage Rating (DC): 50V; Length: 1mm
R18 R20 R23 = CMP-1011-00001-2: Manufacturer: Yageo / Phycomp; Part Number: RC0402JR-070RL
R24 = CMP-1011-00881-2: Manufacturer: Vishay Dale; Part Number: CRCW04022M00FKED
U13 U17 = CMP-04896-000044-1: IC COMPARATOR NANO-POWER SC70-5; Max Supply Voltage: 6.5V; Propagation Delay: 35us; Quiescent Current: 150nA; Max Input Current: 100pA; Min Supply Voltage: 900mV; Number of Elements: 1; Min Dual Supply Voltage: 450mV; Max Dual Supply Voltage: 3.25V; Output Current: 42mA; Input Offset Voltage (Vos): 3mV; Response Time: 24us; Packaging: Tape and Reel; Type: General Purpose; RoHS Compliant: Yes; Number of Pins: 5; Max Operating Temperature: 125°C; Input Bias Current: 100pA; Mount: Surface Mount; Radiation Hardening: No; Contact Plating: Gold; Number of Channels: 1; Min Operating Temperature: -40°C; Package Quantity: 3000; Lead Free: Lead Free; Case/Package: SC
U14 = CMP-0023-00299-1: 200kOhm, Digital Potentiometer with 3-Wire Serial SPI Control Interface, Non-Volatile, Linear Taper, 256 Steps, -40 to 85 degC, 8-pin TDFN-EP (T833+2), Pb-Free, Tape and Reel; PartNumber: MAX5424ETA+T; ComponentLink3URL: http://pdfserv.maximintegrated.com/package_dwgs/21-0137.PDF; PackageDescription: 8-Pin Plastic Very Very Thin Dual Flatpack No Leads, Exposed Pad (T833+2); PackageVersion: Rev. J, 08/2009; ComponentLink2Description: Datasheet; ComponentLink1Description: Manufacturer URL; ComponentLink2URL: http://datasheets.maximintegrated.com/en/ds/MAX5422-MAX5424.pdf; Code_JEDEC: MO229; ComponentLink1URL: http://www.maximintegrated.com/; PackageReference: T833+2; Control Interface: 3-Wire Serial SPI; Features: EEPROM Wiper Memory; DatasheetVersion: Rev. 0; Mounting Technology: Surface Mount; ComponentLink3Description: Package Specification
U16 = CMP-0859-00978-3: Low-Power Single Positive-Edge-Triggered D-Type Flip-Flop, RSE0008A, LARGE T&R; Manufacturer: Texas Instruments; Bits(#): 1; VCC(Max)(V): 3.6; Voltage(Nom)(V): 0.8,1.2,1.5,1.8,2.5,3.3; Output Type: CMOS; Technology Family: AUP; VCC(Min)(V): 0.8; ICC @ Nom Voltage(Max)(mA): 0.0009; F @ Nom Voltage(Max)(Mhz): 100; Output Drive (IOL/IOH)(Max)(mA): 20/-20; Rating: Catalog; Schmitt Trigger: No; tpd @ Nom Voltage(Max)(ns): 38,26,17,13,9,7; Logic: True; Generic Part Number: SN74AUP1G74; Operating Temperature Range(C): -40 to 85; DatasheetVersion: SCES644C; Sub-Family: D-Type Flip-Flop; 3-State Output: No; PackageReference: RSE0008A; Input Type: CMOS
U18 = XTPS61094DSSR: No Description Available; SourceLibrary: Add_to_database_2021-03-17; Built_By: EMA_Matt; Vendor: Texas Instruments; Datasheet: https://www.ti.com/lit/ds/symlink/tps61094.pdf?ts=1615883226162; Manufacturer_Part_Number: XTPS61094DSSR; Copyright: Copyright (C) 2018 Accelerated Designs. All rights reserved; RefDes: RefDes; Type: DEV
U19 = IC_Intersil_ISL21080DIH309Z-TK_eec: IC VREF SERIES 0.9V SOT23-3; Part Number: ISL21080DIH309Z-TK; helpURL: https://upverter.com/upn/revision/cea4d3e56c7c7365/; ComponentLink2Description: Datasheet; Temperature: -40°C to +85°C; Package: SOT23-3; Supplier 2: Mouser; Price: 1.15623202851; Supplier 1: Digi-Key; ComponentLink1URL: https://upverter.com/upn/revision/cea4d3e56c7c7365/; Supplier Part Number 2: 968-ISL21080DIH309ZT; Supplier Part Number 1: ISL21080DIH309Z-TKCT-ND; Manufacturer: Intersil; ComponentLink1Description: Upverter; ComponentLink2URL: https://www.intersil.com/content/dam/Intersil/documents/isl2/isl21080.pdf; RoHS: TRUE; Mouser Part Number: 968-ISL21080DIH309ZT; Temperature Range High: +85°C; Digikey Description: IC VREF SERIES 0.9V SOT23-3; Digikey Part Number: ISL21080DIH309Z-TKCT-ND; Lead Free: yes; Temperature Range Low: -40°C